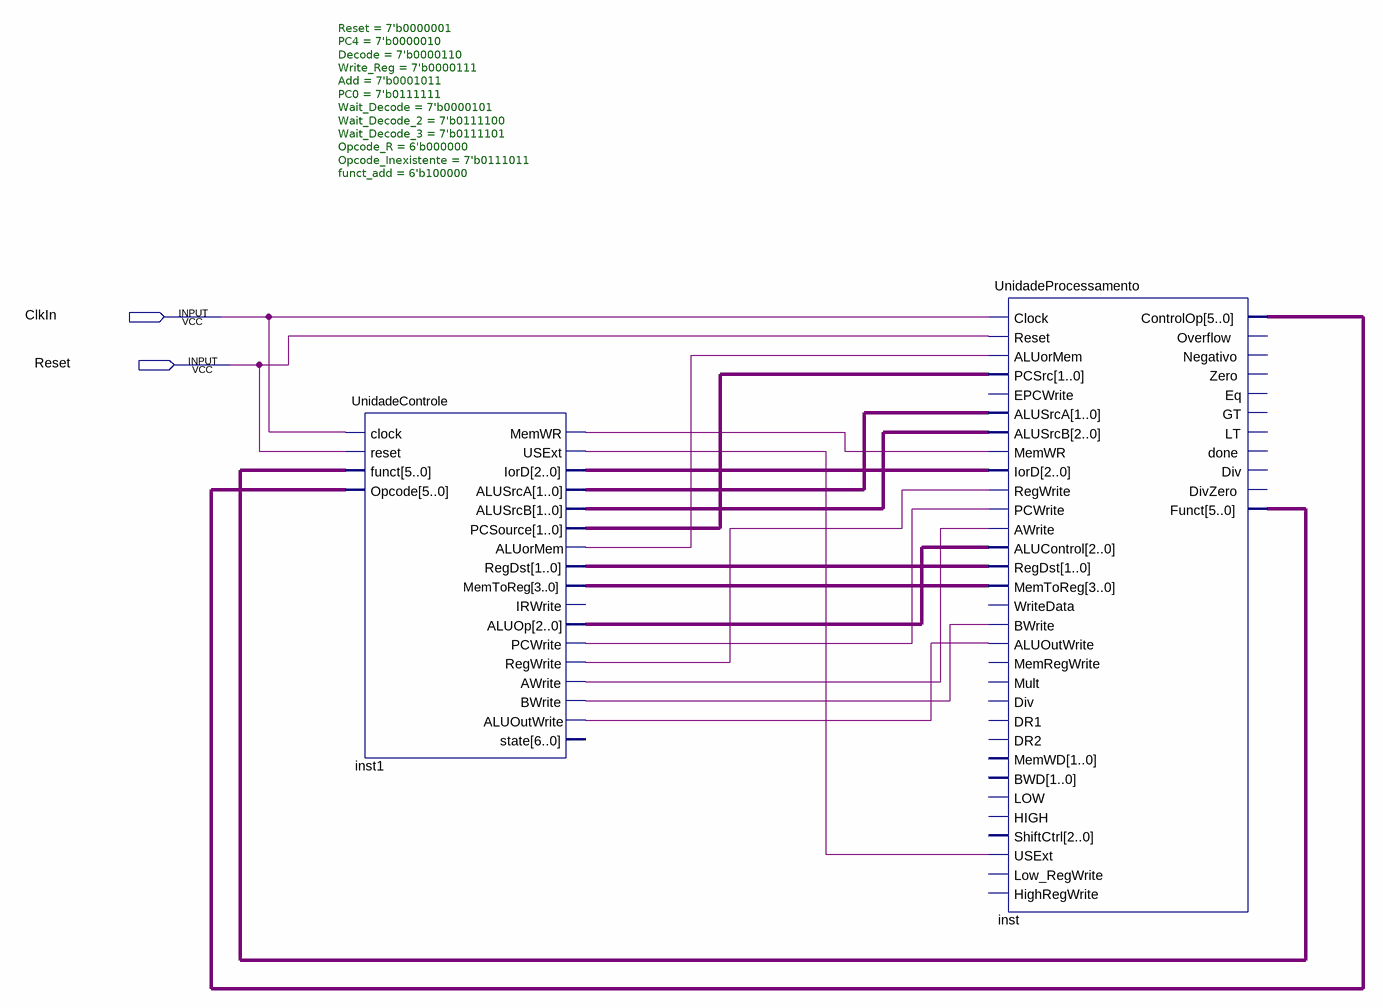
[diagram p0: schematic sheet]
// Quartus schematic Proc_Control.bdf as structural Verilog: 2 symbols, 2 pins
module Proc_Control (
  input  ClkIn,
  input  Reset
);

  wire inst1_aluormem, inst1_aluoutwrite, inst1_awrite, inst1_bwrite, inst1_memwr, inst1_pcwrite,
       inst1_regwrite, inst1_usext;
  wire [1:0] inst1_alusrca, inst1_pcsource, inst1_regdst;
  wire [2:0] inst1_aluop, inst1_alusrcb, inst1_iord;
  wire [3:0] inst1_memtoreg;
  wire [5:0] inst_controlop, inst_funct;

  UnidadeControle #(.Reset(7'b0000001), .PC4(7'b0000010), .Decode(7'b0000110), .Write_Reg(7'b0000111), .Add(7'b0001011), .PC0(7'b0111111), .Wait_Decode(7'b0000101), .Wait_Decode_2(7'b0111100), .Wait_Decode_3(7'b0111101), .Opcode_R(6'b000000), .Opcode_Inexistente(7'b0111011), .funct_add(6'b100000)) inst1 (
    .clock(ClkIn), .reset(Reset), .funct(inst_funct), .Opcode(inst_controlop), .MemWR(inst1_memwr),
    .USExt(inst1_usext), .IorD(inst1_iord), .ALUSrcA(inst1_alusrca), .ALUSrcB(inst1_alusrcb),
    .PCSource(inst1_pcsource), .ALUorMem(inst1_aluormem), .RegDst(inst1_regdst), .MemToReg(inst1_memtoreg),
    .ALUOp(inst1_aluop), .PCWrite(inst1_pcwrite), .RegWrite(inst1_regwrite), .AWrite(inst1_awrite),
    .BWrite(inst1_bwrite), .ALUOutWrite(inst1_aluoutwrite));  // open: IRWrite, state
  UnidadeProcessamento inst (
    .Clock(ClkIn), .Reset(Reset), .ALUorMem(inst1_aluormem), .PCSrc(inst1_pcsource), .ALUSrcA(inst1_alusrca),
    .ALUSrcB(inst1_alusrcb), .MemWR(inst1_memwr), .IorD(inst1_iord), .RegWrite(inst1_regwrite),
    .PCWrite(inst1_pcwrite), .AWrite(inst1_awrite), .ALUControl(inst1_aluop), .RegDst(inst1_regdst),
    .MemToReg(inst1_memtoreg), .BWrite(inst1_bwrite), .ALUOutWrite(inst1_aluoutwrite), .USExt(inst1_usext),
    .ControlOp(inst_controlop), .Funct(inst_funct));  // open: EPCWrite, WriteData, MemRegWrite, Mult, Div, DR1, DR2, MemWD, BWD, LOW, HIGH, ShiftCtrl, Low_RegWrite, HighRegWrite, Overflow, Negativo, Zero, Eq, GT, LT, done, DivZero
endmodule
